# EAGLE design PrismScreen (EAGLE 7.6.0)
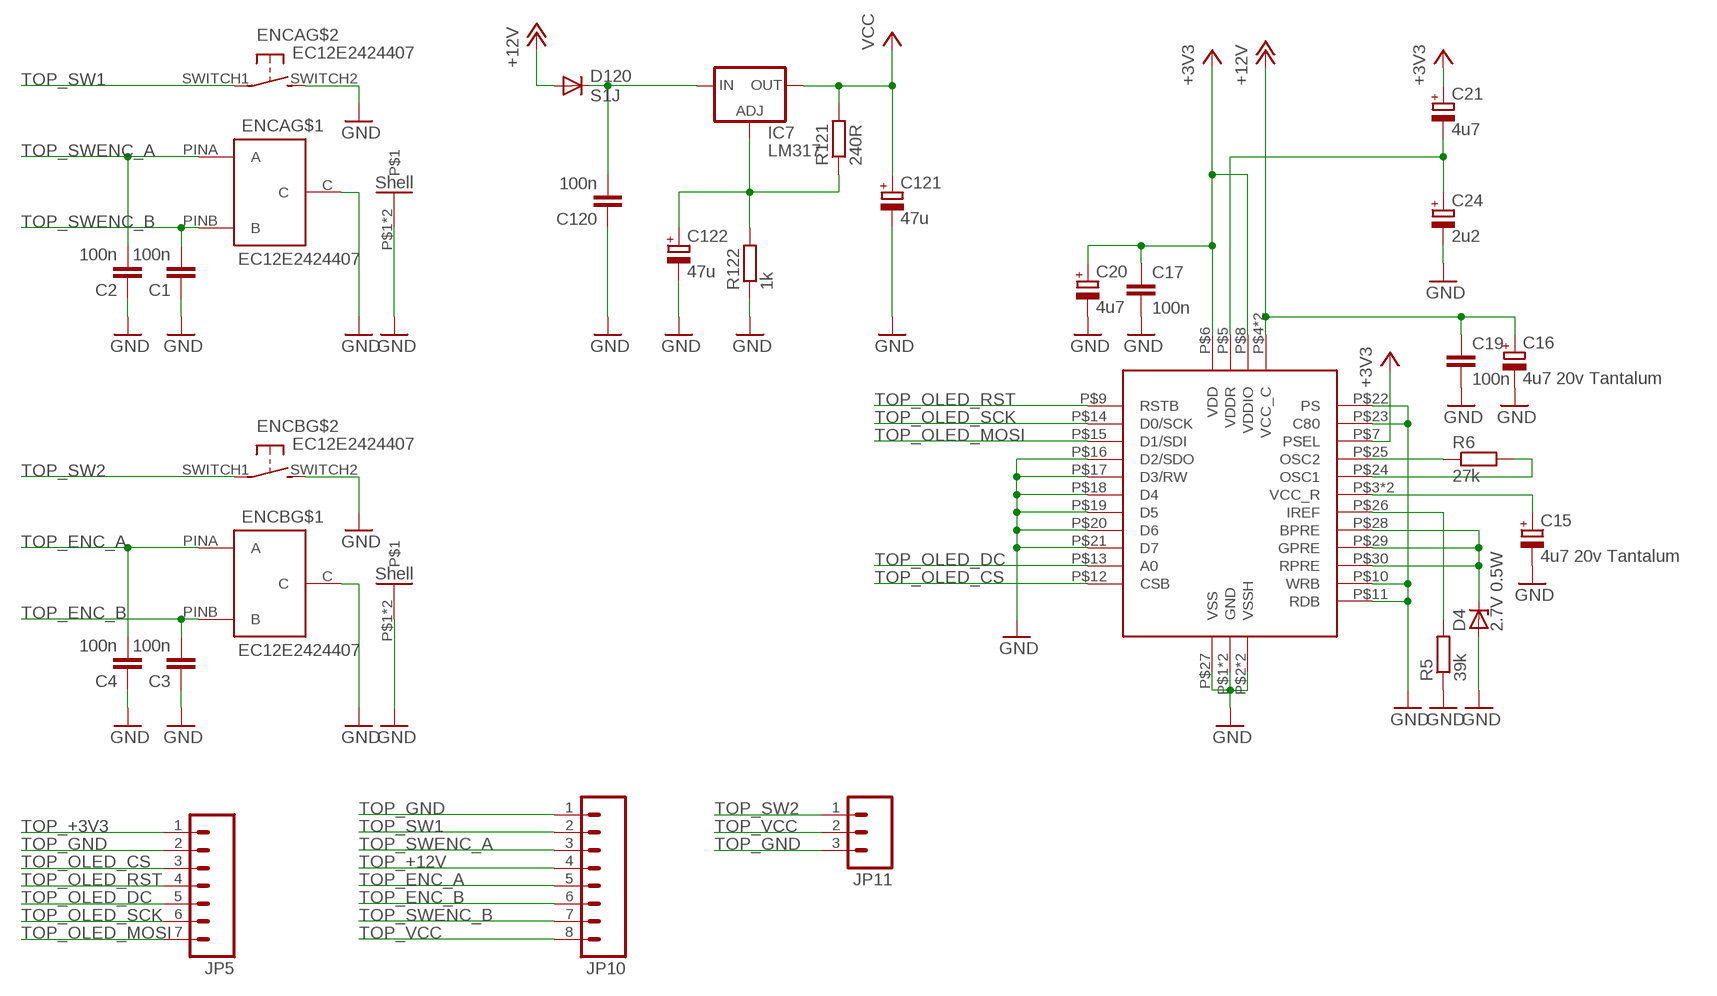
[diagram p0: schematic, sheet 1]

## Parts
C1  100n  C-EUC0603  [C0603]
C2  100n  C-EUC0603  [C0603]
C3  100n  C-EUC0603  [C0603]
C4  100n  C-EUC0603  [C0603]
C15  4u7 20v Tantalum  CPOL-EUCT3216  [CT3216]
C16  4u7 20v Tantalum  CPOL-EUCT3216  [CT3216]
C17  100n  C-EUC0603  [C0603]
C19  100n  C-EUC0603  [C0603]
C20  4u7  CPOL-EU153CLV-0405  [153CLV-0405]
C21  4u7  CPOL-EU153CLV-0405  [153CLV-0405]
C24  2u2  CPOL-EU153CLV-0405  [153CLV-0405]
C120  100n  C-EUC0603  [C0603]
C121  47u  CPOL-EU153CLV-0505  [CPOL-5]
C122  47u  CPOL-EU153CLV-0505  [CPOL-5]
D4  2.7V 0.5W  ZENER-DIODESOD80C  [SOD80C]
D120  S1J  DIODESMA  [SMA-DIODE]
ENCA  EC12E2424407  [EC12E2424407]
ENCB  EC12E2424407  [EC12E2424407]
IC7  LM317  LM317MDT  [DPACK]
JP5  M07  [1X07]
JP10  M081X08  [1X08]
JP11  M03PTH  [1X03]
R5  39k  R-EU_0603  [0603]
R6  27k  R-EU_0603  [0603]
R121  240R  R-EU_0603  [0603]
R122  1k  R-EU_0603  [0603]
U$1  MCOT096096AY  [MCOT096096AY]

## Nets
N$3: C120.2 D120.C IC7.3(IN)
N$9: C15.+ U$1.P$3(VCC_R) U$1.P$32(VCC_R)
N$16: C122.+ IC7.1(ADJ) R121.1 R122.2
N$23: C21.- C24.+ U$1.P$5(VDDR)
N$29: D4.C U$1.P$28(BPRE) U$1.P$29(GPRE) U$1.P$30(RPRE)
N$30: R6.1 U$1.P$25(OSC2)
N$31: R6.2 U$1.P$24(OSC1)
N$32: R5.2 U$1.P$26(IREF)
TOP_+3V3: C17.1 C20.+ C21.+ JP5.1 U$1.P$6(VDD) U$1.P$7(PSEL) U$1.P$8(VDDIO) ; supply symbol labelled +3V3
TOP_+12V: C16.+ C19.1 D120.A JP10.4 U$1.P$4(VCC_C) U$1.P$31(VCC_C) ; supply symbol labelled +12V
TOP_ENC_A: C4.2 ENCB.PINA(A) JP10.5
TOP_ENC_B: C3.2 ENCB.PINB(B) JP10.6
TOP_GND: C1.1 C2.1 C3.1 C4.1 C15.- C16.- C17.2 C19.2 C20.- C24.- C120.1 C121.- C122.- D4.A ENCA.C ENCA.P$1 ENCA.P$2 ENCA.SWITCH2(S) ENCB.C ENCB.P$1 ENCB.P$2 ENCB.SWITCH2(S) JP5.2 JP10.1 JP11.3 R5.1 R122.1 U$1.P$1(GND) U$1.P$2(VSSH) U$1.P$10(WRB) U$1.P$11(RDB) U$1.P$16(D2/SDO) U$1.P$17(D3/RW) U$1.P$18(D4) U$1.P$19(D5) U$1.P$20(D6) U$1.P$21(D7) U$1.P$22(PS) U$1.P$23(C80) U$1.P$27(VSS) U$1.P$33(VSSH) U$1.P$34(GND) ; supply symbol labelled GND
TOP_OLED_CS: JP5.3 U$1.P$12(CSB)
TOP_OLED_DC: JP5.5 U$1.P$13(A0)
TOP_OLED_MOSI: JP5.7 U$1.P$15(D1/SDI)
TOP_OLED_RST: JP5.4 U$1.P$9(RSTB)
TOP_OLED_SCK: JP5.6 U$1.P$14(D0/SCK)
TOP_SW1: ENCA.SWITCH1(P) JP10.2
TOP_SW2: ENCB.SWITCH1(P) JP11.1
TOP_SWENC_A: C2.2 ENCA.PINA(A) JP10.3
TOP_SWENC_B: C1.2 ENCA.PINB(B) JP10.7
TOP_VCC: C121.+ IC7.4(OUT) JP10.8 JP11.2 R121.2 ; supply symbol labelled VCC

## Library data of the parts
C1-C4 C17 C19 C120 = Rebel:C-EU: CAPACITOR, European symbol
C15 C16 C20 C21 C24 C121 C122 = Rebel:CPOL-EU: POLARIZED CAPACITOR, European symbol
D4 = diode:ZENER-DIODE: Z-Diode
D120 = SparkFun:DIODE: Diode These are standard reverse protection diodes and small signal diodes. SMA package can handle up to about 1A. SOD-323 can handle about 200mA. What the SOD-323 package when ordering, there are some mfgs out there that are 5-pin packages.
ENCA ENCB = Rebel:EC12E2424407: rotary encoder with switch EC12E2424407
IC7 = v-reg:LM317?*: 500 mA Adjustable Output Positive Voltage Regulator Source: http://www.onsemi.co.jp .. LM317M-D.PDF
JP5 = SparkFun:M07: Header 7 Standard 7-pin 0.1" header. Use with straight break away headers (SKU : PRT-00116), right angle break away headers (PRT-00553), swiss pins (PRT-00743), machine pins (PRT-00117), and female headers (PRT-00115). NOTES ON THE VARIANTS LOCK and LOCK_LONGPADS... This footprint was designed to help hold the alignment of a through-hole component (i.e. 7-pin header) while soldering it into place. You may notice that each hole has been shifted either up or down by 0.005 of an inch from it's more standard position (which is usually a perfectly straight line). This slight alteration caused the pins (the squares in the middle) to touch the edges of the holes. Because they are alternating, it causes a "brace" to hold the header in place. 0.005 has proven to be the perfect amount of "off-center" position when using our standard breakaway headers. Although looks a little odd when you look at the bare footprint, once you have a header in there, the alteration is very hard to notice. Also, if you push a header all the way into place, it is covered up entirely on the bottom side. This idea of altering the position of holes to aid alignment will be further integrated into the Sparkfun Library for other footprints. It can help hold any component with 3 or more connection pins.
JP10 = SparkFun:M08: Header 8 Standard 8-pin 0.1" header. Use with straight break away headers (SKU : PRT-00116), right angle break away headers (PRT-00553), swiss pins (PRT-00743), machine pins (PRT-00117), and female headers (PRT-00115).
JP11 = SparkFun:M03: Header 3 Standard 3-pin 0.1" header. Use with straight break away headers (SKU : PRT-00116), right angle break away headers (PRT-00553), swiss pins (PRT-00743), machine pins (PRT-00117), and female headers (PRT-00115). Molex polarized connector foot print use with SKU : PRT-08232 with associated crimp pins and housings.
R5 R6 R121 R122 = Rebel:R-EU_: RESISTOR, European symbol
U$1 = Rebel:MCOT096096AY

## Net classes
1 power: width 0.178 mm, drill 0.305 mm, clearance 0.178 mm to class 0, clearance 0.178 mm

## Board
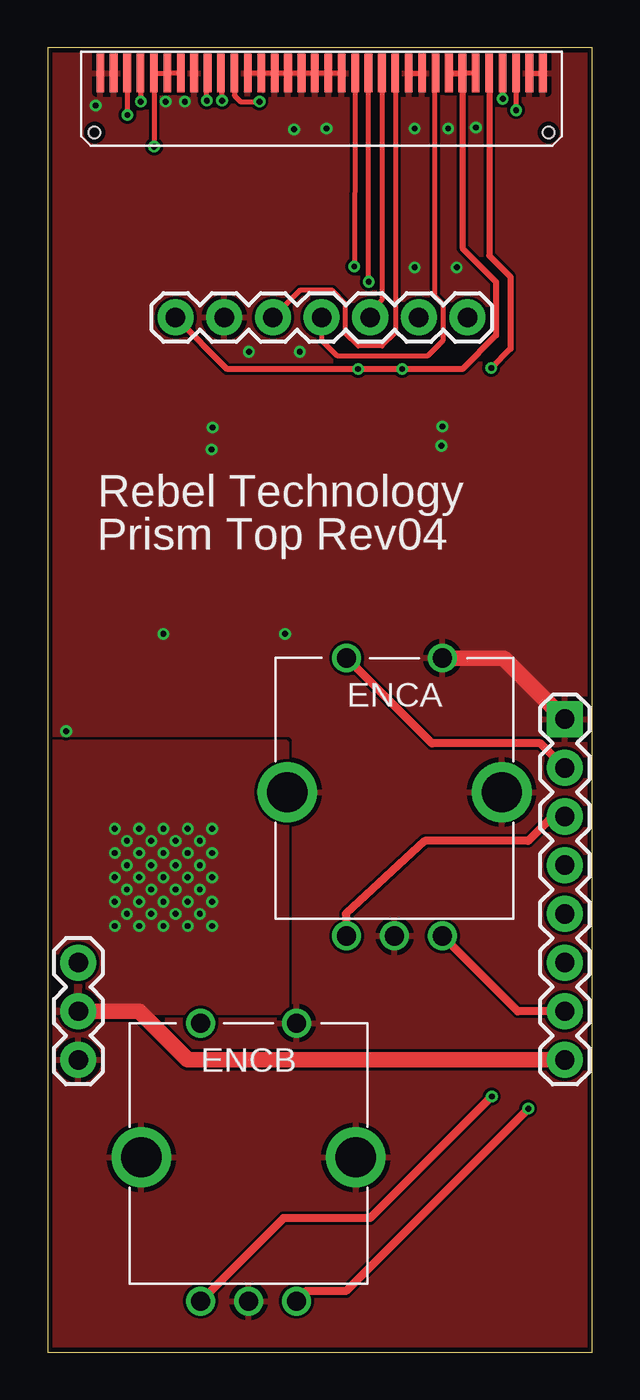
[diagram p1: board, top side]
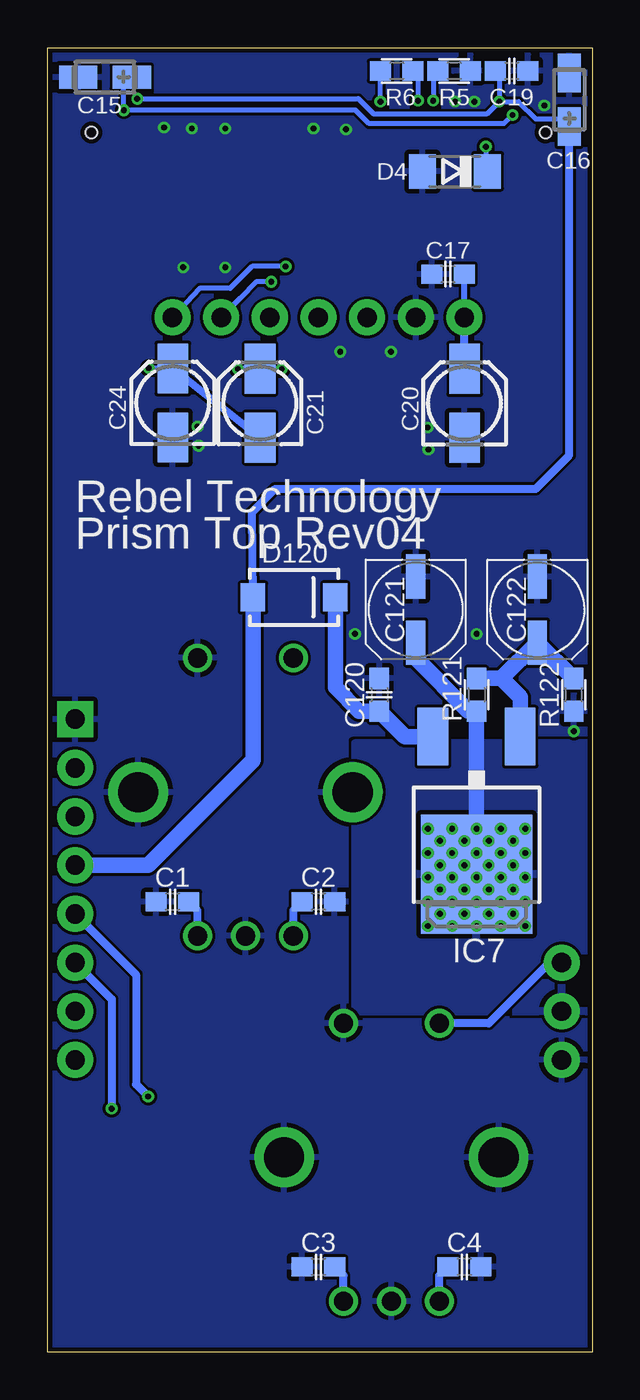
[diagram p2: board, bottom side, seen from below]

Size 28.41 x 68.03 mm. Coordinates in mm from the lower left corner, seen from the top.
Outline: 0,0 28.41,0 28.41,68.03 0,68.03 0,0
Copper layers (1*16): Top 0.035mm / dielectric 1.5mm / Bottom 0.035mm
Design rules "SeeedStudio_2layer_DRU_no_angle_20140221": minimum track width 6mil, minimum drill 12mil, track to track 6mil, track to pad 6mil, pad to pad 6mil, via to via 6mil, smd to smd 0mil, copper to edge 10mil, drill to drill 10mil, minimum pad ring 10mil, minimum via ring 6mil, stop-mask expansion 2mil, vias tented up to drill 100mil, thermal gap 10mil

### Footprints (pad centres in the part's own frame; a part is rotated, then mirrored left to right if it is on the bottom)
C0603 = smd 1.1 x 1: 1 -0.85,0; 2 0.85,0
CT3216 = smd 2 x 1.2: + -1.4,0; - 1.4,0
153CLV-0405 = smd 2.6 x 1.6: + 1.8,0; - -1.8,0
CPOL-5 = smd 2.3 x 1: + 1.725,0; - -1.725,0
SOD80C = smd 1.4 x 1.8: A 1.7,0; C -1.7,0
SMA-DIODE = smd 1.27 x 1.47: A -2.15,0; C 2.15,0
EC12E2424407 = drill 1: C 0,-7.5; PINA -2.5,-7.5; PINB 2.5,-7.5; SWITCH1 -2.5,7; SWITCH2 2.5,7 | drill 2.1: P$1 -5.6,0; P$2 5.6,0
DPACK = smd 1.6 x 3: 1 -2.28,-4.8; 3 2.28,-4.8 | smd 5.8 x 6.2: 4 0,2.38
1X07 = drill 1.016 pad 1.88: 1 0,0; 2 2.54,0; 3 5.08,0; 4 7.62,0; 5 10.16,0; 6 12.7,0; 7 15.24,0
1X08 = drill 1.016 pad 1.88 square: 1 0,0 | drill 1.016 pad 1.88: 2 2.54,0; 3 5.08,0; 4 7.62,0; 5 10.16,0; 6 12.7,0; 7 15.24,0; 8 17.78,0
1X03 = drill 1.016 pad 1.88: 1 0,0; 2 2.54,0; 3 5.08,0
0603 = smd 1.1 x 1: 1 -0.85,0; 2 0.85,0
MCOT096096AY = smd 0.4 x 2: P$1 -11.55,-2; P$2 -10.85,-2; P$3 -10.15,-2; P$4 -9.45,-2; P$5 -8.75,-2; P$6 -8.05,-2; P$7 -7.35,-2; P$8 -6.65,-2; P$9 -5.95,-2; P$10 -5.25,-2; P$11 -4.55,-2; P$12 -3.85,-2; P$13 -3.15,-2; P$14 -2.45,-2; P$15 -1.75,-2; P$16 -1.05,-2; P$17 -0.35,-2; P$18 0.35,-2; P$19 1.05,-2; P$20 1.75,-2; P$21 2.45,-2; P$22 3.15,-2; P$23 3.85,-2; P$24 4.55,-2; P$25 5.25,-2; P$26 5.95,-2; P$27 6.65,-2; P$28 7.35,-2; P$29 8.05,-2; P$30 8.75,-2; P$31 9.45,-2; P$32 10.15,-2; P$33 10.85,-2; P$34 11.55,-2 | hole 0.6: 11.85,1.1; -11.85,1.1

### Placement (x,y rotation side)
C1  21.91,23.49 0 bottom
C2  14.29,23.49 180 bottom
C3  14.29,4.45 0 bottom
C4  6.67,4.45 180 bottom
C15  25.43,66.51 180 bottom
C16  1.19,65.33 90 bottom
C17  7.52,56.23 180 bottom
C19  4.2,66.83 0 bottom
C20  6.66,49.49 90 bottom
C21  17.34,49.5 90 bottom
C24  21.89,49.52 90 bottom
C120  11.11,34.29 270 bottom
C121  9.21,38.73 270 bottom
C122  2.86,38.73 270 bottom
D4  7.16,61.59 180 bottom
D120  15.56,39.37 0 bottom
ENCA  18.1,29.21 0 top
ENCB  10.48,10.16 0 top
IC7  6.03,27.3 180 bottom
JP5  6.67,53.98 0 top
JP10  26.99,33.02 270 top
JP11  1.59,20.32 270 top
R5  7.2,66.83 180 bottom
R6  10.2,66.83 180 bottom
R121  6.03,34.29 270 bottom
R122  0.95,34.29 90 bottom
U$1  14.29,64.72 180 top

### Tracks (layer width: path | path; a pad name or v marks a point on that pad's centre or on a via)
N$3
  Bottom 0.813: IC7.3 9.78,32.11 C120.2 12.17,33.44 13.41,34.68 D120.C
N$9  (via drill 0.3)
  Top 0.254: v24.45,64.78 U$1.P$3 | U$1.P$32 v4.14,64.55 v4.15,64.53
  Bottom 0.254: v4.15,64.53 4.6,64.08 11.65,64.08 12.35,64.78 v24.45,64.78 24.45,66.09 C15.+
N$16
  Bottom 0.813: R122.2 0.99,35.14 C122.+ 4.73,35.14 | R121.1 4.73,35.14 | IC7.1 3.75,34.16 4.73,35.14
N$23  (via drill 0.3)
  Top 0.305: U$1.P$5 23.04,57.2 24.15,56.09 24.15,52.34 v23.15,51.34
  Bottom 0.305: v23.15,51.34 21.91,51.34 C24.+
  Bottom 0.406: C21.- C24.+
N$29  (via drill 0.3)
  Top 0.254: U$1.P$28 U$1.P$29 U$1.P$30 v5.54,62.9 v5.55,62.89
  Bottom 0.254: v5.55,62.89 5.57,61.69 D4.C
N$30  (via drill 0.3)
  Top 0.254: v9.1,65.28 9.1,66.81 U$1.P$25
  Bottom 0.254: R6.1 9.1,66.58 v9.1,65.28
N$31  (via drill 0.3)
  Top 0.254: U$1.P$24 9.74,65.55 10.05,65.23 v11.05,65.23
  Bottom 0.254: v11.05,65.23 R6.2
N$32  (via drill 0.3)
  Top 0.254: v8.3,65.28 8.3,66.83 U$1.P$26
  Bottom 0.254: R5.2 8.3,66.58 v8.3,65.28
TOP_+3V3  (via drill 0.3)
  Top 0.254: U$1.P$8 U$1.P$7 U$1.P$6
  Top 0.305: U$1.P$8 U$1.P$7 21.65,57.59 23.4,55.84 23.4,53.04 21.65,51.29 v18.5,51.29 v16.2,51.29 9.36,51.29 JP5.1
  Bottom 0.254: 6.67,56.13 C17.1
  Bottom 0.305: JP5.1 6.67,56.13 | C21.+ 18.48,51.3 arc-90 v18.5,51.29 | v16.2,51.29 16.8,51.29
  Bottom 0.406: C20.+ JP5.1
TOP_+12V  (via drill 0.3)
  Top 0.254: U$1.P$31 v4.85,65.23 | U$1.P$4 23.74,65.42 v23.75,65.38
  Bottom 0.254: C19.1 4.85,66.63 v4.85,65.23 | v4.85,65.23 3.85,65.23 2.95,64.33 1.59,64.33 C16.+ | v4.85,65.23 5.5,64.58 11.4,64.58 12.2,65.38 v23.75,65.38
  Bottom 0.406: D120.A 17.76,43.83 16.55,45.04 2.95,45.04 1.19,46.79 C16.+
  Bottom 0.813: JP10.4 23.18,25.4 17.71,30.87 D120.A
TOP_ENC_A  (via drill 0.3)
  Top 0.406: v23.18,13.34 16.83,6.99 12.3,6.99 ENCB.PINA
  Bottom 0.406: ENCB.PINA 7.98,3.99 C4.2 | JP10.5 23.81,19.68 23.81,13.97 v23.18,13.34
TOP_ENC_B  (via drill 0.3)
  Top 0.406: v25.08,12.7 15.56,3.17 13.49,3.17 ENCB.PINB
  Bottom 0.406: ENCB.PINB 12.98,3.99 C3.2 | JP10.6 25.08,18.41 v25.08,12.7
TOP_GND  (via drill 0.3)
  Top 0.254: U$1.P$16 U$1.P$17 U$1.P$18 U$1.P$19 U$1.P$20 U$1.P$21 U$1.P$22 U$1.P$23 | U$1.P$11 U$1.P$10 | U$1.P$2 U$1.P$1
  Top 0.813: 20.64,36.2 23.81,36.2 JP10.1
  other vias: 0.95,32.39 12.38,37.47 6.03,37.47 19.15,63.84 20.6,48.29 20.55,47.29 8.6,48.23 8.55,47.09 10.5,52.19 13.15,52.19 12.85,63.79 14.55,63.84 19.15,56.59 21.35,56.59 22.35,63.88 20.9,63.84 6.15,65.23 7.15,65.23 2.5,65.03
  pour Bottom (rank 2): -3.39,69.21 -3.49,0 32.07,0 32.17,69.21
  pour Top (rank 2): -3.39,69.18 -3.49,0 32.07,0 32.17,69.18
TOP_OLED_CS
  Top 0.254: U$1.P$12 18.14,53.18 17.45,52.48 16.2,52.48 15.55,53.14 15.55,54.69 14.85,55.39 13.16,55.39 JP5.3
TOP_OLED_DC
  Top 0.254: U$1.P$13 17.44,54.88 16.8,54.23 16.8,54.01 JP5.5
TOP_OLED_MOSI  (via drill 0.3)
  Top 0.254: U$1.P$15 16.04,64.34 v16,56.64
  Bottom 0.254: v16,56.64 17.75,56.64 18.9,55.48 20.5,55.48 JP5.7
TOP_OLED_RST
  Top 0.254: JP5.4 14.29,52.8 15.1,51.98 19.85,51.98 20.65,52.79 20.65,54.64 20.2,55.09 20.2,66.68 U$1.P$9
TOP_OLED_SCK  (via drill 0.3)
  Top 0.254: v16.75,55.84 U$1.P$14
  Bottom 0.254: v16.75,55.84 17.55,55.84 18.37,54.97 JP5.6
TOP_SW1
  Top 0.406: JP10.2 25.72,31.75 20.06,31.75 ENCA.SWITCH1
TOP_SW2
  Bottom 0.406: JP11.1 2.22,20.32 5.4,17.14 7.96,17.14 ENCB.SWITCH1
TOP_SWENC_A
  Top 0.406: JP10.3 26.35,27.94 25.08,26.67 19.68,26.67 15.56,22.86 15.56,21.75 ENCA.PINA
  Bottom 0.406: ENCA.PINA 15.6,23.04 C2.2
TOP_SWENC_B
  Top 0.406: JP10.7 24.53,17.78 ENCA.PINB
  Bottom 0.406: ENCA.PINB 20.6,23.04 C1.2
TOP_VCC  (via drill 0.3)
  Top 0.813: JP11.2 4.76,17.78 7.3,15.24 JP10.8
  Bottom 0.813: v6.03,24.76 IC7.4 | v6.03,27.3 R121.2 6.45,33.44 9.21,36.2 C121.+
  other vias: 3.49,22.22 4.76,27.3 4.13,26.67 4.76,26.04 3.49,26.04 4.13,25.4 3.49,24.76 4.13,24.13 3.49,23.49 4.13,22.86 4.76,23.49 4.76,24.76 5.4,25.4 5.4,24.13 5.4,26.67 6.03,26.04 6.67,26.67 7.3,27.3 7.94,26.67 8.57,27.3 8.57,26.04 7.3,26.04 6.67,25.4 7.94,25.4 8.57,24.76 7.3,24.76 6.67,24.13 7.94,24.13 8.57,23.49 7.3,23.49 6.03,23.49 5.4,22.86 4.76,22.22 6.03,22.22 6.67,22.86 7.94,22.86 7.3,22.22 8.57,22.22 3.49,27.3
  pour Top: -0.32,31.75 12.38,31.75 12.38,17.78 -0.32,17.78
  pour Bottom: -0.32,31.75 12.38,31.75 12.38,17.78 -0.32,17.78

### Text on the board
tPlace: Rebel Technology | Prism Top Rev04
bPlace: Rebel Technology | Prism Top Rev04